# Altium schematic sheet DMD_Card_Modules.SchDoc
size A3; DrawnBy: Hanif; Organization: AFRA Technology; DocumentNumber: 2; SheetNumber: 2; SheetTotal: 2
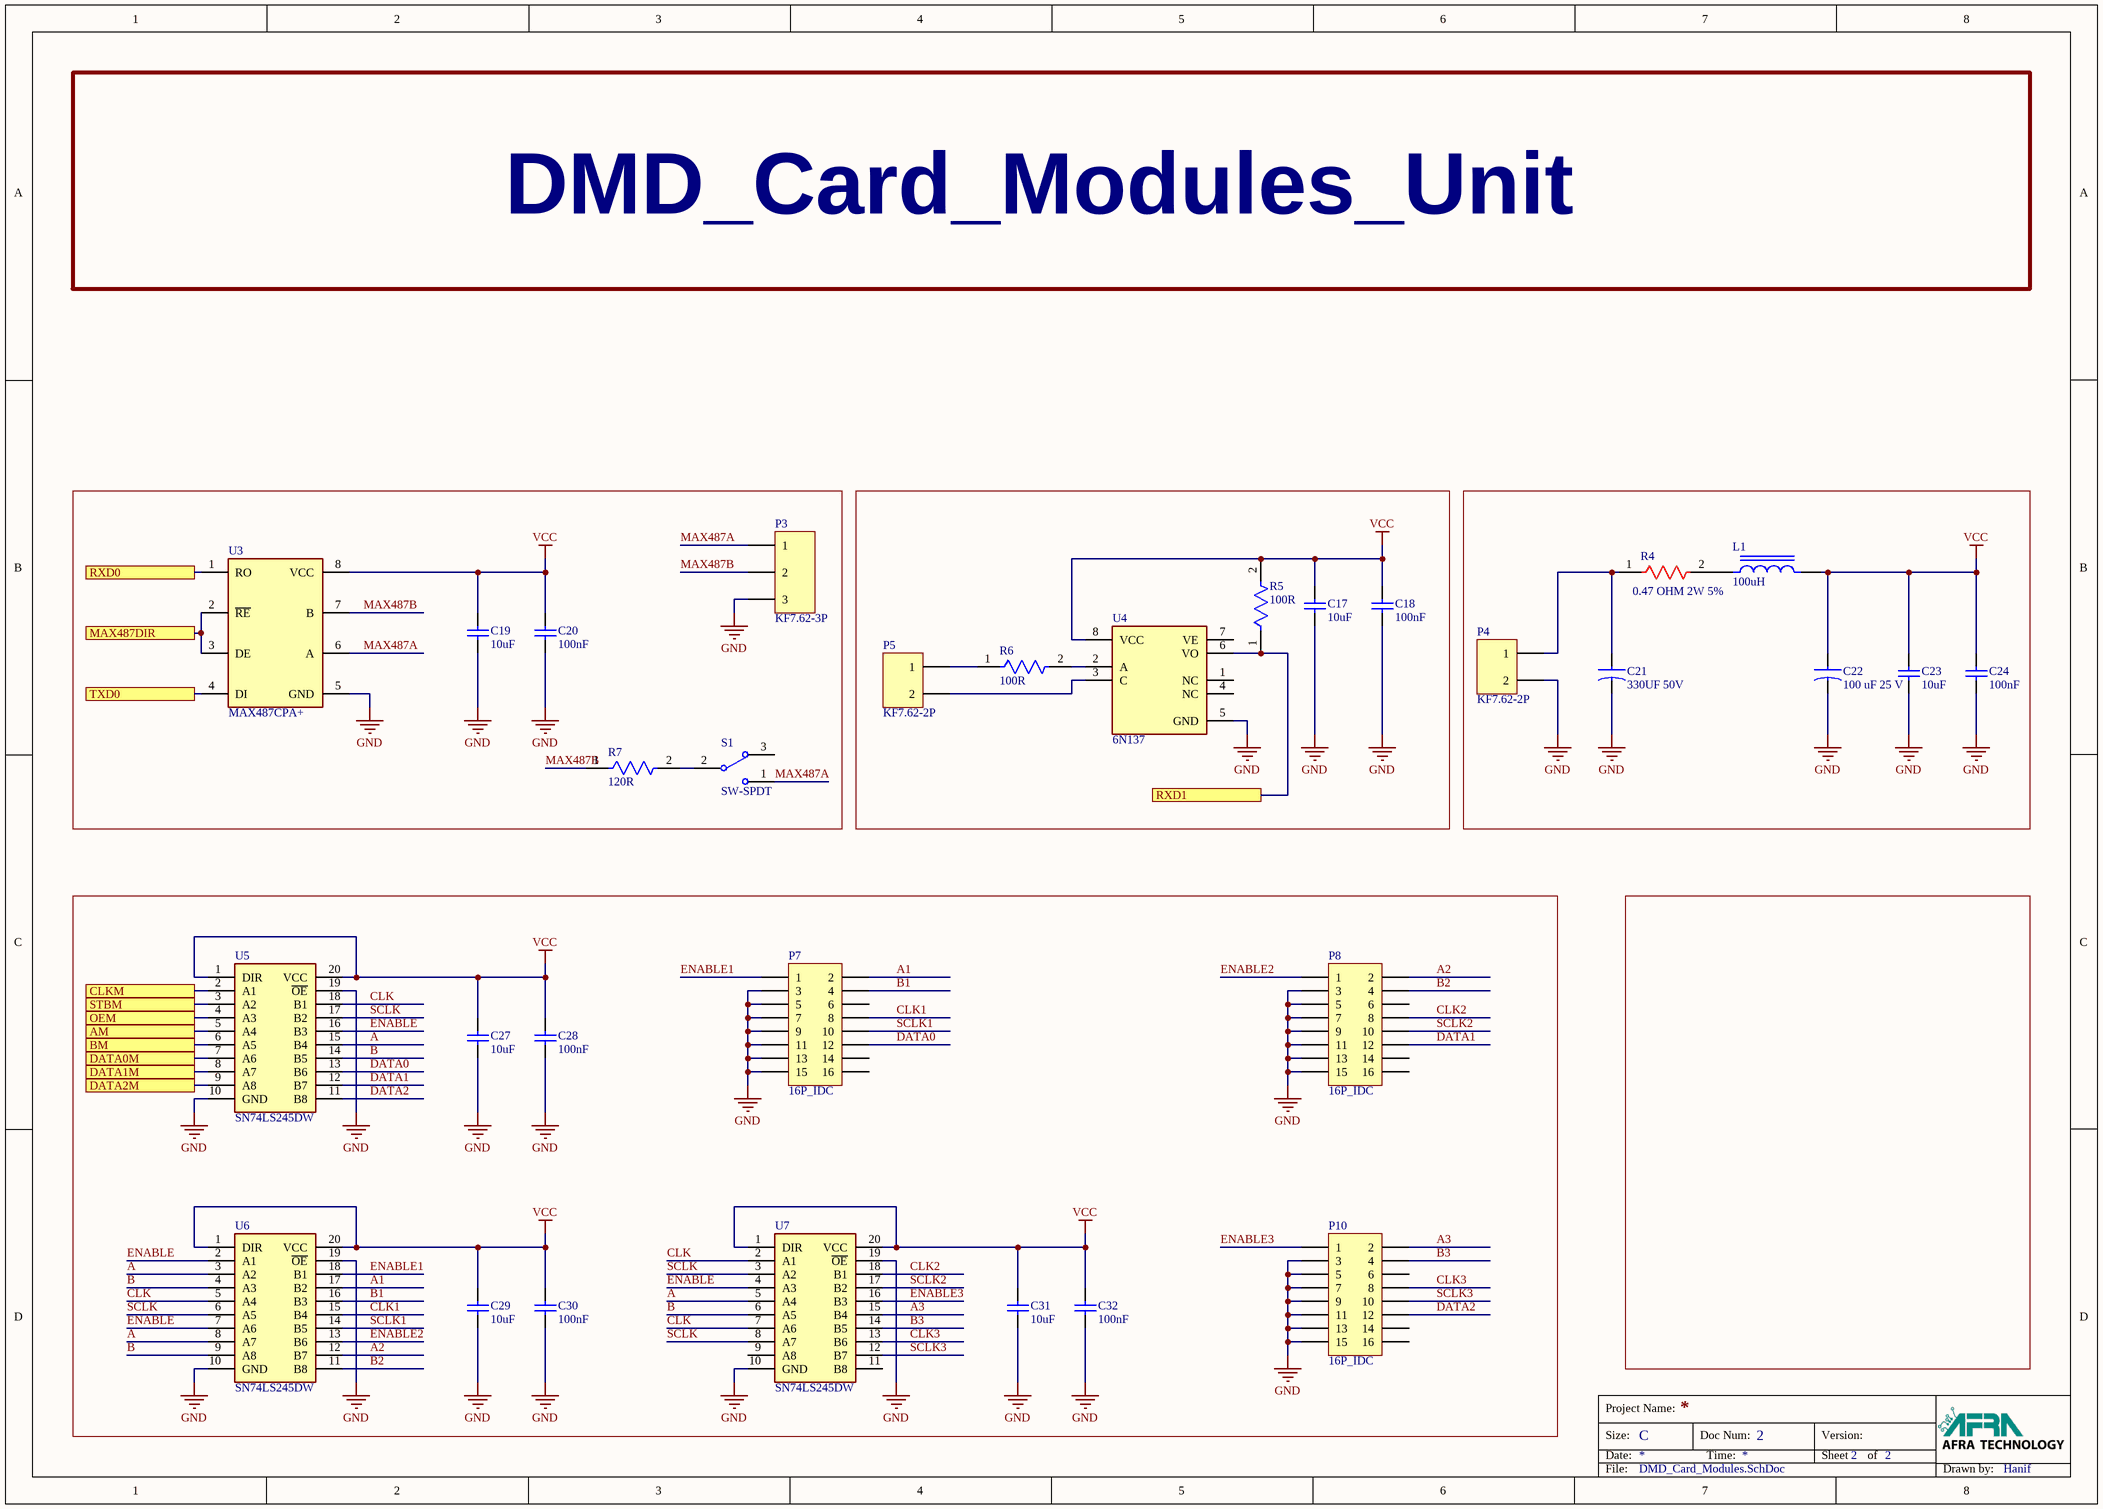
[diagram p0: DMD_Card_Modules.SchDoc]

## Parts
C17  10uF  [Yageo_CC1206-1.25_IPC_A]
C18  100nF  [Yageo_CC1206-1.25_IPC_A]
C19  10uF  [Yageo_CC1206-1.25_IPC_A]
C20  100nF  [Yageo_CC1206-1.25_IPC_A]
C21  330UF 50V  [Multy_Radial_Capacitor]
C22  100 uF 25 V  [Multy_Radial_Capacitor]
C23  10uF  [Yageo_CC1206-1.25_IPC_A]
C24  100nF  [Yageo_CC1206-1.25_IPC_A]
C27  10uF  [Yageo_CC1206-1.25_IPC_A]
C28  100nF  [Yageo_CC1206-1.25_IPC_A]
C29  10uF  [Yageo_CC1206-1.25_IPC_A]
C30  100nF  [Yageo_CC1206-1.25_IPC_A]
C31  10uF  [Yageo_CC1206-1.25_IPC_A]
C32  100nF  [Yageo_CC1206-1.25_IPC_A]
L1  100uH  [Radia_03]
P3  KF7.62-3P  [KF7.62-3P Barrier Terminal Block]
P4  KF7.62-2P  [KF7.62-2P Barrier Terminal Block]
P5  KF7.62-2P  [KF7.62-2P Barrier Terminal Block]
P7  16P_IDC  [16Pin_IDC_Connector]
P8  16P_IDC  [16Pin_IDC_Connector]
P10  16P_IDC  [16Pin_IDC_Connector]
R4  0.47 OHM 2W 5%  [Axial 0.6]
R5  100R  [Yageo_RT1206_IPC_A]
R6  100R  [Yageo_RT1206_IPC_A]
R7  120R  [AXIAL 0.4]
S1  SW-SPDT  [Toggle Switch_SPDT]
U3  MAX487CPA+  [DIP_08]
U4  Part Number: 6N137  [DIP_08]  (hidden comment: IC_Vishay_6N137_eec)
U5  SN74LS245DW  [SOIC127P1030X265-20N]
U6  SN74LS245DW  [SOIC127P1030X265-20N]
U7  SN74LS245DW  [SOIC127P1030X265-20N]

## Ports
AM, BM, CLKM, DATA0M, DATA1M, DATA2M, MAX487DIR, OEM, RXD0, RXD1, STBM, TXD0

## Nets
GND: C17.1 C18.1 C19.1 C20.1 C21.2 C22.2 C23.1 C24.1 C27.1 C28.1 C29.1 C30.1 C31.1 C32.1 P3.3 P4.2 P7.3 P7.5 P7.7 P7.9 P7.11 P7.13 P7.15 P8.3 P8.5 P8.7 P8.9 P8.11 P8.13 P8.15 P10.3 P10.5 P10.7 P10.9 P10.11 P10.13 P10.15 U3.5(GND) U4.5(GND) U5.10(GND) U5.19(~{OE}) U6.10(GND) U6.19(~{OE}) U7.10(GND) U7.19(~{OE})
VCC: C17.2 C18.2 C19.2 C20.2 C22.1 C23.2 C24.2 C27.2 C28.2 C29.2 C30.2 C31.2 C32.2 L1.2 R5.2 U3.8(VCC) U4.8(VCC) U5.1(DIR) U5.20(VCC) U6.1(DIR) U6.20(VCC) U7.1(DIR) U7.20(VCC)
A: U5.15(B4) U6.3(A2) U6.8(A7) U7.5(A4)
A1: P7.2 U6.17(B2)
A2: P8.2 U6.12(B7)
A3: P10.2 U7.15(B4)
AM: U5.5(A4) ; port AM
B: U5.14(B5) U6.4(A3) U6.9(A8) U7.6(A5)
B1: P7.4 U6.16(B3)
B2: P8.4 U6.11(B8)
B3: P10.4 U7.14(B5)
BM: U5.6(A5) ; port BM
CLK: U5.18(B1) U6.5(A4) U7.2(A1) U7.7(A6)
CLK1: P7.8 U6.15(B4)
CLK2: P8.8 U7.18(B1)
CLK3: P10.8 U7.13(B6)
CLKM: U5.2(A1) ; port CLKM
DATA0: P7.12 U5.13(B6)
DATA0M: U5.7(A6) ; port DATA0M
DATA1: P8.12 U5.12(B7)
DATA1M: U5.8(A7) ; port DATA1M
DATA2: P10.12 U5.11(B8)
DATA2M: U5.9(A8) ; port DATA2M
ENABLE: U5.16(B3) U6.2(A1) U6.7(A6) U7.4(A3)
ENABLE1: P7.1 U6.18(B1)
ENABLE2: P8.1 U6.13(B6)
ENABLE3: P10.1 U7.16(B3)
MAX487A: P3.1 S1.1 U3.6(A)
MAX487B: P3.2 R7.1 U3.7(B)
MAX487DIR: U3.2(~{RE}) U3.3(DE) ; port MAX487DIR
OEM: U5.4(A3) ; port OEM
RXD0: U3.1(RO) ; port RXD0
RXD1: R5.1 U4.6(VO) ; port RXD1
SCLK: U5.17(B2) U6.6(A5) U7.3(A2) U7.8(A7)
SCLK1: P7.10 U6.14(B5)
SCLK2: P8.10 U7.17(B2)
SCLK3: P10.10 U7.12(B7)
STBM: U5.3(A2) ; port STBM
TXD0: U3.4(DI) ; port TXD0
NetC21_1: C21.1 P4.1 R4.1
NetL1_1: L1.1 R4.2
NetP5_1: P5.1 R6.1
NetP5_2: P5.2 U4.3(C)
NetR6_2: R6.2 U4.2(A)
NetR7_2: R7.2 S1.2

Not connected (* = marked no-connect by the designer): P7 6 14 16; P8 6 14 16; P10 6 14 16; S1 3; U4 1(NC) 4(NC) 7(VE); U7 9(A8) 11(B8)

## Notes on the sheet
- DMD_Card_Modules_Unit
- Project Name:
- Size:
- Date:
- C
- Doc Num:
- Time:
- Version:
- Sheet
- of
- File:
- Drawn by:

## Library data of the parts
C17 C19 C23 C27 C29 C31 = CC1206KRX7R7BB334
C18 C20 C24 C28 C30 C32 = CC1206KRX7R7BB104
C21 = 330 uF 50 V Electrolytic Capacitors: Aluminum Electrolytic Capacitors Radial, Can - 10000 Hrs @ 105°C; Manufacturer: Rubycon; Manufacturer Part Number: 50YXJ330M10X20; Tolerance: 20%; Ripple Current: 1.22A; Impedance: 60mR; Life (Hours): 10000Hour; Supplier 1: Digi-Key; RoHS: Yes; Category: Aluminum Electrolytic Capacitors; Stock 1: 72; Pricing 1: 1=0.82000, 10=0.57600, 50=0.43560, 100=0.37940, 500=0.28106, 1000=0.23890, 2500=0.22485, 5000=0.21080 (USD); Mount: Through Hole; Case/Package: Radial; Min Operating Temperature: -40°C; Max Operating Temperature: 105°C; Capacitance: 330uF; Termination: Radial; Package Quantity: 1000; Voltage Rating: 50V; Packaging: Bulk; Voltage Rating (DC): 50V; Series: YXJ; Diameter: 10mm; Height: 20mm; Lead Pitch: 5mm; Height - Seated (Max): 0.866inch; Radiation Hardening: No; REACH SVHC: No SVHC; RoHS Compliant: Yes; ComponentLink1URL: https://datasheet.ciiva.com/46371/1657883-46371898.pdf?src-supplier=Element14; ComponentLink1Description: https://datasheet.ciiva.com/46371/1657883-46371898.pdf?src-supplier=Element14; ComponentLink2URL: https://datasheet.ciiva.com/17513/e-yxj-17513675.pdf?src-supplier=Avnet+Europe; ComponentLink2Description: https://datasheet.ciiva.com/17513/e-yxj-17513675.pdf?src-supplier=Avnet+Europe; Supplier Part Number 1: 1189-1424-ND
C22 = 100 uF 25 V Electrolytic Capacitor: RZ Series Radial 25 V 100 uF Ø 6.3 x 11 mm 105 °C Electrolytic Capacitor; Manufacturer: Samwha; Manufacturer Part Number: RZ1E107M6L011BB280; Capacitance: 100uF; Voltage Rating: 25V; Supplier 1: Future Electronics; RoHS: Yes; Pricing 1: 3600=0.03300 (USD); Case/Package: Radial; Lead Free: Lead Free; ComponentLink1URL: http://www.samwha.com/electric/product/list_pdf2/RZ.pdf?src-supplier=Future+Electronics; ComponentLink1Description: http://www.samwha.com/electric/product/list_pdf2/RZ.pdf?src-supplier=Future+Electronics; Supplier Part Number 1: 1048642
L1 = RLB0812-101KL: FIXED IND 100UH 320MA 600 MOHM; Manufacturer: Bourns; Core Material: Ferrite; Tolerance: 10%; Self Resonant Frequency: 4.2MHz; Shielding: Unshielded; DC Resistance (DCR): 600mR; Q Factor: 45; Test Frequency: 796kHz; Lead/Base Style: Radial; Lead Diameter: 0.65mm; Supplier 1: Digi-Key; Manufacturer Part Number: RLB0812-101KL; RoHS: Yes; Category: Fixed Inductors; Stock 1: 1145; Pricing 1: 1=0.40000, 10=0.35200, 25=0.30800, 50=0.26400, 100=0.24200, 250=0.22000, 500=0.20680, 1000=0.15840, 2500=0.14960 (USD); Mount: Through Hole; Case/Package: Radial; Min Operating Temperature: -40°C; Max Operating Temperature: 105°C; Package Quantity: 400; Packaging: Bulk; Current Rating: 320mA; Inductance: 100uH; Max DC Current: 320mA; Termination: Radial; DC Current: 320mA; Series: RLB; Diameter: 6.7mm; Length: 10mm; Height: 0.394inch; Lead Pitch: 3mm; Radiation Hardening: No; Military Standard: Not; RoHS Compliant: Yes; ComponentLink1URL: https://datasheet.ciiva.com/1069/rlb-1069242.pdf?src-supplier=Digi-Key; ComponentLink1Description: https://datasheet.ciiva.com/1069/rlb-1069242.pdf?src-supplier=Digi-Key; ComponentLink2URL: https://datasheet.ciiva.com/4960/rlb-4960710.pdf?src-supplier=Mouser; ComponentLink2Description: https://datasheet.ciiva.com/4960/rlb-4960710.pdf?src-supplier=Mouser; ComponentLink3URL: https://datasheet.ciiva.com/8110/rlb-8110999.pdf?src-supplier=Avnet; ComponentLink3Description: https://datasheet.ciiva.com/8110/rlb-8110999.pdf?src-supplier=Avnet; Supplier Part Number 1: RLB0812-101KL-ND
P3 = KF7.62-3P Barrier Terminal Block: KF7.62-3P Barrier Terminal Block, 7.62mm spacing barrier terminals with side expandable slot. The terminal accepts wire gauge of 22~12AWG. Connectors are available black PA66 material.
P4 P5 = KF7.62-2P Barrier Terminal Block: KF7.62-2P Barrier Terminal Block, 7.62mm spacing barrier terminals with side expandable slot. The terminal accepts wire gauge of 22~12AWG. Connectors are available black PA66 material.
P7 P8 P10 = BHR-16-VUA: Headers & Wire Housings 16P STRAIGHT; Manufacturer: Adam Equipment; Current Rating: 1A; Number of Positions: 16; Pitch: 2.54mm; Supplier 1: Digi-Key; Manufacturer Part Number: BHR-16-VUA; RoHS: Yes; Category: Connectors; Stock 1: 804; Pricing 1: 1=0.45000, 10=0.42400, 100=0.29690, 500=0.25452, 1000=0.21210, 5000=0.18180, 10000=0.16968 (USD); Contact Plating: Gold; Contact Material: Brass; Package Quantity: 276; Number of Rows: 2; Packaging: Tray; Orientation: Straight; Termination: IDC; Lead Free: Lead Free; ComponentLink1URL: https://datasheet.ciiva.com/16418/page-319-321-16418937.pdf?src-supplier=Future+Electronics; ComponentLink1Description: https://datasheet.ciiva.com/16418/page-319-321-16418937.pdf?src-supplier=Future+Electronics; Supplier Part Number 1: 2057-BHR-16-VUA-ND
R4 = 2WD47: RESISTOR 2 WATT METAL OXIDE FILM FLAMEPROOF 0.47 OHM 5% AXIAL LEAD; Manufacturer: NTE Electronics; Resistance: 470mR; Temperature Coefficient: 200ppm/°C; Supplier 1: Newark; Manufacturer Part Number: 2WD47; RoHS: Yes; Category: Through-Hole Resistors; Pricing 1: 1=0.18800 (USD); Mount: Through Hole; Case/Package: Metal; Weight: 0.0024lb; Min Operating Temperature: -55°C; Max Operating Temperature: 200°C; Tolerance: 5%; Power Rating: 2W; Termination: Axial; Length: 3.25inch; Width: 0.25inch; Height: 0.25inch; RoHS Compliant: No; ComponentLink1URL: http://www.onlinecomponents.com/productFiles/mf-NTE/twow.pdf?src-supplier=Onlinecomponents.com; ComponentLink1Description: http://www.onlinecomponents.com/productFiles/mf-NTE/twow.pdf?src-supplier=Onlinecomponents.com; ComponentLink2URL: http://www.alliedelec.com/m/d/d44ce2bb19ec670cc5afc3c1f91c41cf.pdf?src-supplier=Allied+Electronics; ComponentLink2Description: http://www.alliedelec.com/m/d/d44ce2bb19ec670cc5afc3c1f91c41cf.pdf?src-supplier=Allied+Electronics; Supplier Part Number 1: 33C8349
R5 R6 = RT1206BRD07100RL
R7 = 120R 1/4W: RES 120 OHM 1/4W 0.1% AXIAL; Manufacturer: Yageo; Manufacturer Part Number: MFP-25BRD52-120R; Max Power Dissipation: 250mW; Temperature Coefficient: 25ppm/°C; Supplier 1: Digi-Key; RoHS: Yes; Category: Through-Hole Resistors; Stock 1: 4420; Pricing 1: 1=0.70000, 10=0.49900, 25=0.38960, 50=0.32960, 100=0.25970, 250=0.21972, 500=0.17978, 1000=0.13983 (USD); Case/Package: Axial; Min Operating Temperature: -55°C; Max Operating Temperature: 155°C; Package Quantity: 1; Resistance: 120R; Tolerance: 0.1%; Packaging: Tape and Reel; Resistor Type: Metal Film; Number of Terminations: 2; Series: MFP; Length: 0.248inch; Lead Free: Lead Free; RoHS Compliant: Yes; ComponentLink1URL: https://datasheet.ciiva.com/2713/yageolr-mfp-2013-2713048.pdf?src-supplier=Digi-Key; ComponentLink1Description: https://datasheet.ciiva.com/2713/yageolr-mfp-2013-2713048.pdf?src-supplier=Digi-Key; ComponentLink2URL: https://datasheet.ciiva.com/2713/yageolr-mfp-2013-2713049.pdf?src-supplier=Digi-Key; ComponentLink2Description: https://datasheet.ciiva.com/2713/yageolr-mfp-2013-2713049.pdf?src-supplier=Digi-Key; Supplier Part Number 1: 120ADCT-ND
S1 = SW-SPDT: SPDT Subminiature Toggle Switch, Right Angle Mounting, Vertical Actuation; Published: 24-Mar-1999; LatestRevisionDate: 17-Dec-2003; LatestRevisionNote: Schematic revised, PCB Footprint replaced.; DatasheetVersion: 05-Dec-2000; PackageReference: TL36WW15050; Publisher: Altium Limited; PackageDescription: Switch; 4 Leads; ComponentLink1Description: Manufacturer Link; ComponentLink1URL: http://www.apem.com
U3 = MAX487ECPA+: Interface IC RS422/485 DIL-8, MAX487ECPA+, Maxim; Operating Supply Voltage: 5V; Number of Transmitters: 1; Logic Function: Transceiver; Data Rate: 256Kbps; Max Power Dissipation: 727mW; Output Voltage: 3V; Propagation Delay: 250ns; Max Supply Voltage: 5.25V; Min Supply Voltage: 4.75V; Nominal Supply Current: 250uA; Interface: RS-422,RS-485; Simplex/Duplex: Half Duplex; Supplier 1: Digi-Key; Manufacturer: Maxim; Manufacturer Part Number: MAX487ECPA+; RoHS: Yes; Category: Interface ICs; Stock 1: 285; Pricing 1: 1=4.05000, 10=3.63500, 25=3.43680, 100=3.05500 (USD); Mount: Through Hole; Case/Package: DIP; Number of Pins: 8; Min Operating Temperature: 0°C; Max Operating Temperature: 70°C; Packaging: Rail/Tube; Package Quantity: 50; Number of Receivers: 1; Number of Transceivers: 1; Series: -; Number of Drivers: 1; Supply Current: 250uA; Length: 9.91mm; Width: 7.87mm; Height: 4.45mm; Radiation Hardening: No; Lead Free: Lead Free; RoHS Compliant: Yes; REACH SVHC: No SVHC; ComponentLink1URL: https://datasheet.ciiva.com/16973/0900766b8078aed8-16973392.pdf?src-supplier=Allied+Electronics; ComponentLink1Description: https://datasheet.ciiva.com/16973/0900766b8078aed8-16973392.pdf?src-supplier=Allied+Electronics; ComponentLink2URL: https://datasheet.ciiva.com/16640/max1487e-max491e-16640614.pdf?src-supplier=Avnet+Europe; ComponentLink2Description: https://datasheet.ciiva.com/16640/max1487e-max491e-16640614.pdf?src-supplier=Avnet+Europe; ComponentLink3URL: https://datasheet.ciiva.com/8075/3976-8075401.pdf?src-supplier=Element14; ComponentLink3Description: https://datasheet.ciiva.com/8075/3976-8075401.pdf?src-supplier=Element14; ComponentLink4URL: https://datasheet.ciiva.com/14430/max1487e-max491e-14430329.pdf?src-supplier=Avnet; ComponentLink4Description: https://datasheet.ciiva.com/14430/max1487e-max491e-14430329.pdf?src-supplier=Avnet; ComponentLink5URL: https://datasheet.ciiva.com/14152/jxmax481e-491e-e-14152719.pdf?src-supplier=Distrelec; ComponentLink5Description: https://datasheet.ciiva.com/14152/jxmax481e-491e-e-14152719.pdf?src-supplier=Distrelec; ComponentLink6URL: https://datasheet.ciiva.com/1713/max1487e-max491e-1713146.pdf?src-supplier=Digi-Key; ComponentLink6Description: https://datasheet.ciiva.com/1713/max1487e-max491e-1713146.pdf?src-supplier=Digi-Key; ComponentLink7URL: https://datasheet.ciiva.com/4785/max1487e-max491e-4785914.pdf?src-supplier=Mouser; ComponentLink7Description: https://datasheet.ciiva.com/4785/max1487e-max491e-4785914.pdf?src-supplier=Mouser; Supplier Part Number 1: MAX487ECPA+-ND
U4 = IC_Vishay_6N137_eec: IC OPTOISO 5.3KV 1CH OPN DRAIN 8DIP; Manufacturer: Vishay; helpURL: https://upverter.com/upn/revision/90ff24e5d1aaa85f/; ComponentLink2Description: Datasheet; Temperature: -40°C to +100°C; Package: DIP8; Supplier 2: Mouser; Price: 1.00620280459; Supplier 1: Digi-Key; ComponentLink1URL: https://upverter.com/upn/revision/90ff24e5d1aaa85f/; Supplier Part Number 2: 782-6N137; Supplier Part Number 1: 751-1262-5-ND; ComponentLink1Description: Upverter; ComponentLink2URL: http://www.vishay.com/docs/84732/6n137.pdf; RoHS: TRUE; Mouser Part Number: 782-6N137; Ipc Land Pattern Name: DIP762W50P254L1016H425Q8; Temperature Range High: +100°C; Digikey Description: IC OPTOISO 5.3KV 1CH OPN DRAIN 8DIP; Digikey Part Number: 751-1262-5-ND; Lead Free: yes; Temperature Range Low: -40°C
U5-U7 = SN74LS245DW: Integrated Circuit; Manufacturer_Name: Texas Instruments; Datasheet Link: http://www.ti.com/lit/gpn/sn74ls245; Height: 2.65mm; Manufacturer_Part_Number: SN74LS245DW; Mouser Part Number: 595-SN74LS245DW; Mouser Price/Stock: https://www.mouser.co.uk/ProductDetail/Texas-Instruments/SN74LS245DW/?qs=ZA235jQDfbpxKQZqDHbgmw%3D%3D; Arrow Part Number: SN74LS245DW; Arrow Price/Stock: https://www.arrow.com/en/products/sn74ls245dw/texas-instruments